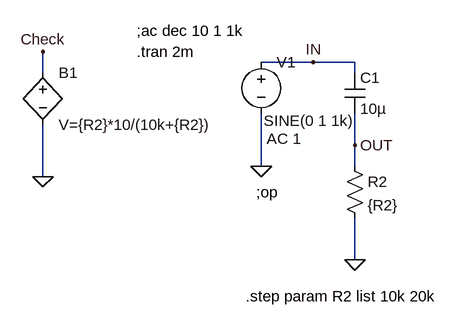
[diagram p0: schematic Intro_LTSpice.asc]
Intro_LTSpice.asc, the LTspice schematic file:
Version 4
SHEET 1 880 680
WIRE 16 -144 -64 -144
WIRE 80 -144 16 -144
WIRE -400 -128 -400 -160
WIRE 80 -128 80 -144
WIRE 80 -16 80 -64
WIRE -64 16 -64 -64
WIRE 80 16 80 -16
WIRE -400 32 -400 -48
WIRE 80 160 80 96
FLAG 80 160 0
FLAG -64 16 0
FLAG 16 -144 IN
FLAG 80 -16 OUT
FLAG -400 32 0
FLAG -400 -160 Check
SYMBOL res 64 0 R0
SYMATTR InstName R2
SYMATTR Value {R2}
SYMBOL voltage -64 -160 R0
WINDOW 123 8 134 Left 2
WINDOW 39 0 0 Left 0
WINDOW 3 4 106 Left 2
SYMATTR Value2 AC 1
SYMATTR InstName V1
SYMATTR Value SINE(0 1 1k)
SYMBOL bv -400 -144 R0
SYMATTR InstName B1
SYMATTR Value V={R2}*10/(10k+{R2})
SYMBOL cap 64 -128 R0
SYMATTR InstName C1
SYMATTR Value 10µ
TEXT -72 56 Left 2 !;op
TEXT -88 216 Left 2 !.step param R2 list 10k 20k
TEXT -256 -192 Left 2 !;ac dec 10 1 1k
TEXT -256 -160 Left 2 !.tran 2m

The netlist it stands for:
* Intro_LTSpice.asc
R2 OUT 0 {R2}
V1 IN 0 SINE(0 1 1k) AC 1
B1 Check 0 V={R2}*10/(10k+{R2})
C1 IN OUT 10µ
;op
.step param R2 list 10k 20k
;ac dec 10 1 1k
.tran 2m
.backanno
.end

* Results of the author's LTspice run, read from the files saved beside the schematic
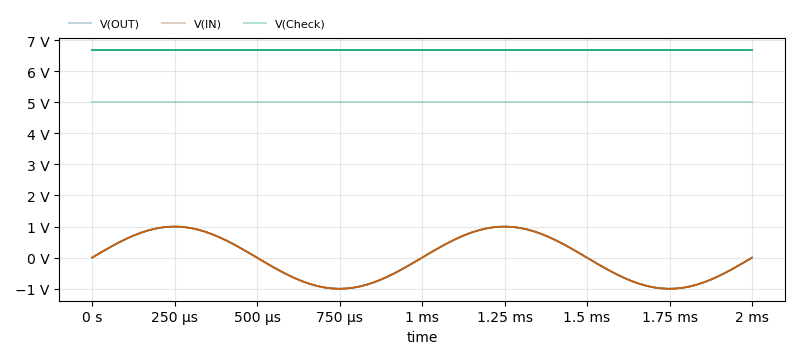
[diagram p1: Transient Analysis of Intro_LTSpice.asc, plotted from the saved traces]
* Transient Analysis, 2 runs:
*   V(OUT) [r2=10000]: min -1.001 V, max 997.5 mV, average -1.577 mV, rms 707 mV, last 31.51 µV
*   V(OUT) [r2=20000]: min -1.001 V, max 998.3 mV, average -792.5 µV, rms 707 mV, last 7.918 µV
*   V(IN) [r2=10000]: min -999.8 mV, max 999.2 mV, average -964.6 nV, rms 707.1 mV, last 0 V
*   V(IN) [r2=20000]: min -999.8 mV, max 999.2 mV, average -690.2 nV, rms 707.1 mV, last 0 V
*   V(Check) [r2=10000]: min 5 V, max 5 V, average 5 V, rms 5 V, last 5 V
*   V(Check) [r2=20000]: min 6.667 V, max 6.667 V, average 6.667 V, rms 6.667 V, last 6.667 V